# Altium schematic sheet 基础四轮--主板.SchDoc
size A3
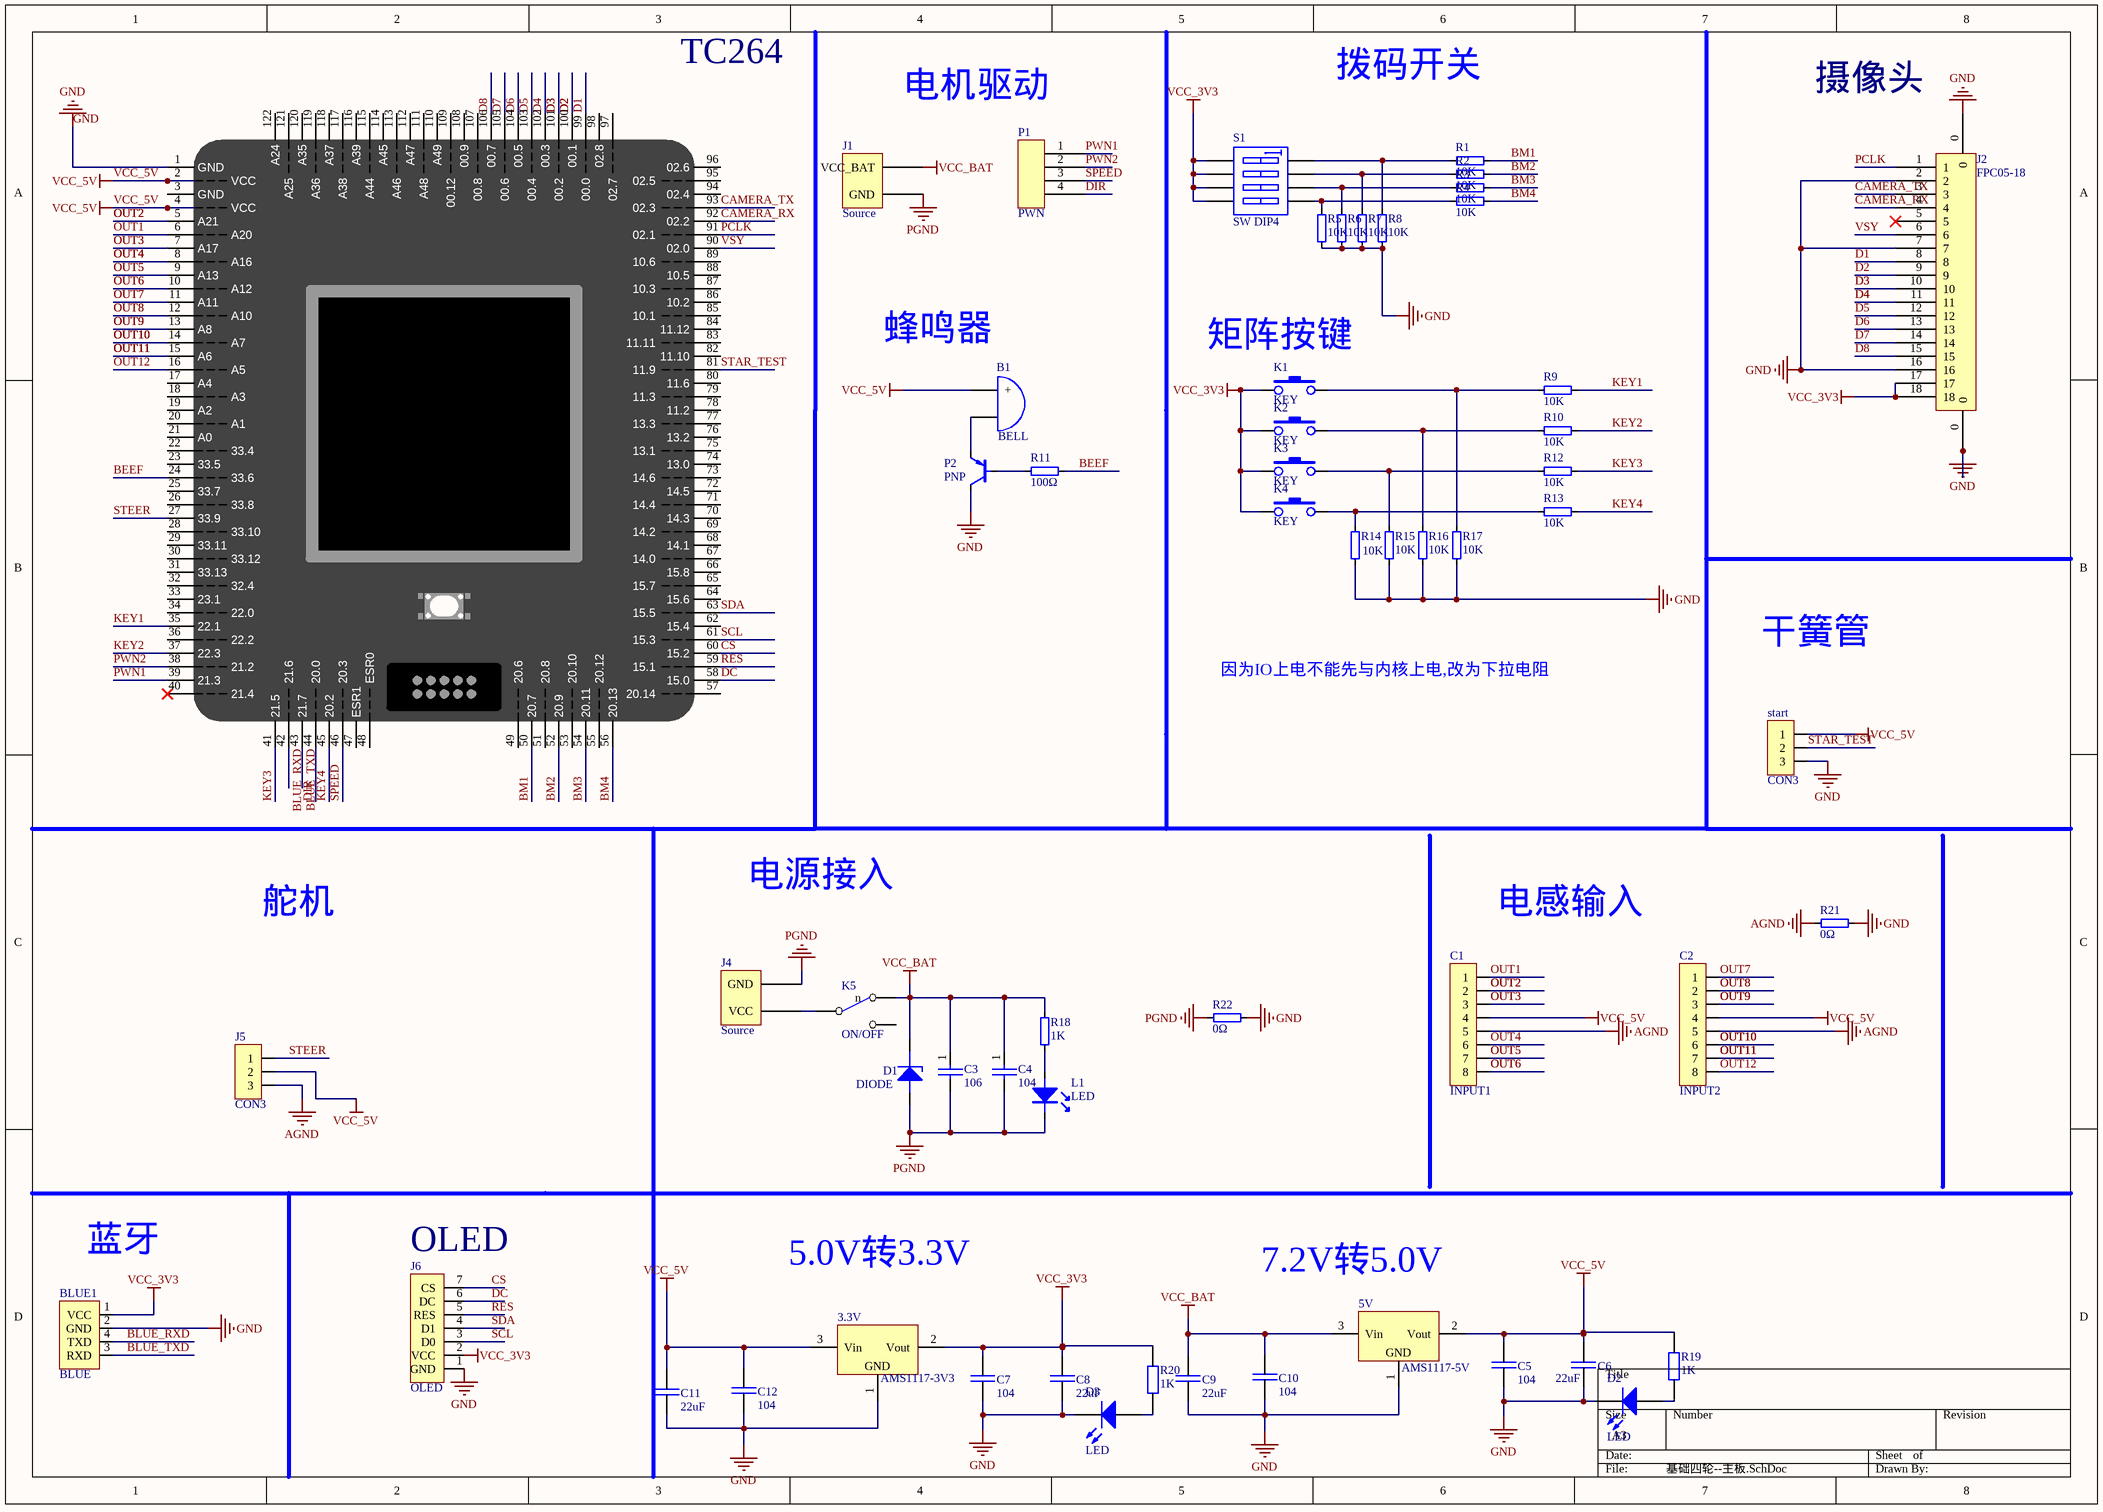
[diagram p0: 基础四轮--主板.SchDoc]

## Parts
3.3V  AMS1117-3V3  [SOT223_L]
5V  AMS1117-5V  [SOT223_L]
B1  BELL  [BELL]
BLUE1  BLUE  [CON4]
C1  INPUT1  [公CON8__INPUT]
C2  INPUT2  [公CON8__INPUT]
C3  106  [C0805]
C4  104  [C0805]
C5  104  [C 0603_L]
C6  22uF  [C 0603_L]
C7  104  [C 0603_L]
C8  22uF  [C 0603_L]
C9  22uF  [C 0603_L]
C10  104  [C 0603_L]
C11  22uF  [C 0603_L]
C12  104  [C 0603_L]
D1  DIODE  [SMA-DIODE]
D2  LED  [LED 0603Y]
D3  LED  [LED 0603B]
J1  Source  [KF 5.08]
J2  FPC05-18  [fpc_05_18p]
J4  Source  [XT30-M]
J5  CON3  [HDR2.54-LI-3P]
J6  OLED  [OLED 1.3-12864_7pin]
K1  KEY  [TSW SMD-3*6*5]
K2  KEY  [TSW SMD-3*6*5]
K3  KEY  [TSW SMD-3*6*5]
K4  KEY  [TSW SMD-3*6*5]
K5  ON/OFF  [拨动开关]
L1  LED  [0805LED]
P1  PWN  [公CON4]
P2  PNP  [SOT-23]
R1  10K  [R0805]
R2  10K  [R0805]
R3  10K  [R0805]
R4  10K  [R0805]
R5  10K  [R0805]
R6  10K  [R0805]
R7  10K  [R0805]
R8  10K  [R0805]
R9  10K  [R0805]
R10  10K  [R0805]
R11  100Ω  [R0805]
R12  10K  [R0805]
R13  10K  [R0805]
R14  10K  [R0805]
R15  10K  [R0805]
R16  10K  [R0805]
R17  10K  [R0805]
R18  1K  [R0805]
R19  1K  [R 0603_L]
R20  1K  [R 0603_L]
R21  0Ω  [R0603 M]
R22  0Ω  [R0603 M]
S1  SW DIP4  [编码开关 4p]
start  CON3  [公CON3]
U1  TC264_CoreBoard  [TC264_CoreBoard]  (value not drawn)

## Nets
AGND: C1.5 C2.5 J5.3 R21.1
GND: 3.3V.1(GND) 5V.1(GND) BLUE1.2(GND) C5.1 C6.1 C7.1 C8.1 C9.1 C10.1 C11.1 C12.1 D2.2(K) D3.2(K) J2.0 J2.2 J2.7 J2.16 J6.1(GND) P2.3(c) R5.1 R6.1 R7.1 R8.1 R14.2 R15.2 R16.2 R17.2 R21.2 R22.2 start.3 U1.1(GND)
PGND: C3.2 C4.2 D1.1 J1.1(GND) J4.2(GND) L1.2 R22.1
VCC_3V3: 3.3V.2(Vout) BLUE1.1(VCC) C7.2 C8.2 J2.17 J2.18 J6.2(VCC) K1.1 K2.1 K3.1 K4.1 R20.2 S1.1(A1) S1.2(A2) S1.3(A3) S1.4(A4)
VCC_5V: 3.3V.3(Vin) 5V.2(Vout) B1.1(+) C1.4 C2.4 C5.2 C6.2 C11.2 C12.2 J5.2 R19.2 start.1 U1.2(VCC) U1.4(VCC)
VCC_BAT: 5V.3(Vin) C3.1 C4.1 C9.2 C10.2 D1.2 J1.2(VCC_BAT) K5.1(n) R18.2
BEEF: R11.2 U1.24(33.6)
BLUE_RXD: BLUE1.4(TXD) U1.42(21.6)
BLUE_TXD: BLUE1.3(RXD) U1.43(21.7)
BM1: R1.2 U1.50(20.7)
BM2: R2.2 U1.52(20.9)
BM3: R3.2 U1.54(20.11)
BM4: R4.2 U1.56(20.13)
CAMERA_RX: J2.4 U1.92(02.2)
CAMERA_TX: J2.3 U1.93(02.3)
CS: J6.7(CS) U1.60(15.2)
D1: J2.8 U1.99(00.0)
D2: J2.9 U1.100(00.1)
D3: J2.10 U1.101(00.2)
D4: J2.11 U1.102(00.3)
D5: J2.12 U1.103(00.4)
D6: J2.13 U1.104(00.5)
D7: J2.14 U1.105(00.6)
D8: J2.15 U1.106(00.7)
DC: J6.6(DC) U1.58(15.0)
DIR: P1.4(PWN2) U1.44(20.0)
KEY1: R9.2 U1.35(22.1)
KEY2: R10.2 U1.37(22.3)
KEY3: R12.2 U1.41(21.5)
KEY4: R13.2 U1.45(20.2)
OUT1: C1.1 U1.6(A20)
OUT2: C1.2 U1.5(A21)
OUT3: C1.3 U1.7(A17)
OUT4: C1.6 U1.8(A16)
OUT5: C1.7 U1.9(A13)
OUT6: C1.8 U1.10(A12)
OUT7: C2.1 U1.11(A11)
OUT8: C2.2 U1.12(A10)
OUT9: C2.3 U1.13(A8)
OUT10: C2.6 U1.14(A7)
OUT11: C2.7 U1.15(A6)
OUT12: C2.8 U1.16(A5)
PCLK: J2.1 U1.91(02.1)
PWN1: P1.1(SPEED) U1.39(21.3)
PWN2: P1.2(DIR) U1.38(21.2)
RES: J6.5(RES) U1.59(15.1)
SCL: J6.3(D0) U1.61(15.3)
SDA: J6.4(D1) U1.63(15.5)
SPEED: P1.3(PWN1) U1.46(20.3)
STAR_TEST: start.2 U1.81(11.9)
STEER: J5.1 U1.27(33.9)
VSY: J2.6 U1.90(02.0)
NetB1_2: B1.2 P2.2(e)
NetD2_1: D2.1(A) R19.1
NetD3_1: D3.1(A) R20.1
NetJ4_1: J4.1(VCC) K5.2(O)
NetK1_2: K1.2 R9.1 R17.1
NetK2_2: K2.2 R10.1 R16.1
NetK3_2: K3.2 R12.1 R15.1
NetK4_2: K4.2 R13.1 R14.1
NetL1_1: L1.1 R18.1
NetP2_1: P2.1(b) R11.1
NetR1_1: R1.1 R8.2 S1.8(B1)
NetR2_1: R2.1 R7.2 S1.7(B2)
NetR3_1: R3.1 R6.2 S1.6(B3)
NetR4_1: R4.1 R5.2 S1.5(B4)

Not connected (* = marked no-connect by the designer): J2 5*; K5 3(COMMON); U1 3(GND) 17(A4) 18(A3) 19(A2) 20(A1) 21(A0) 22(33.4) 23(33.5) 25(33.7) 26(33.8) 28(33.10) 29(33.11) 30(33.12) 31(33.13) 32(32.4) 33(23.1) 34(22.0) 36(22.2) 40(21.4)* 47(ESR1) 48(ESR0) 49(20.6) 51(20.8) 53(20.10) 55(20.12) 57(20.14) 62(15.4) 64(15.6) 65(15.7) 66(15.8) 67(14.0) 68(14.1) 69(14.2) 70(14.3) 71(14.4) 72(14.5) 73(14.6) 74(13.0) 75(13.1) 76(13.2) 77(13.3) 78(11.2) 79(11.3) 80(11.6) 82(11.10) 83(11.11) 84(11.12) 85(10.1) 86(10.2) 87(10.3) 88(10.5) 89(10.6) 94(02.4) 95(02.5) 96(02.6) 97(02.7) 98(02.8) 107(00.8) 108(00.9) 109(00.12) 110(A49) 111(A48) 112(A47) 113(A46) 114(A45) 115(A44) 116(A39) 117(A38) 118(A37) 119(A36) 120(A35) 121(A25) 122(A24)

## Notes on the sheet
- TC264
- 电机驱动
- 拨码开关
- 摄像头
- 蜂鸣器
- (near K1) 矩阵按键
- 干簧管
- 因为IO上电不能先与内核上电,改为下拉电阻
- 舵机
- 电源接入
- 电感输入
- 蓝牙
- (near J6) OLED
- 5.0V转3.3V
- (near 5V) 7.2V转5.0V

## Library data of the parts
3.3V 5V = AMS1117: 三端稳压芯片; BOM名称: 稳压芯片; 淘宝ID: 封装库来自淘宝 ID：黄晶宝石; 欢迎光临淘宝店铺: https://shop463601444.taobao.com
B1 = BELL: 蜂鸣器
BLUE1 = 串口: 蓝牙
C1 C2 = CON-8
C3 C4 = CAP: 二极管
C5-C12 = C 0805: cap 0805
D1 = DIODE: 防反接二极管
D2 D3 = LED: Typical BLUE SiC LED; Published: 8-Jun-2000; LatestRevisionDate: 17-Dec-2003; LatestRevisionNote: PCB Footprint replaced.; DatasheetVersion: 16-Apr-2002; PackageVersion: 16-Apr-2002; PackageReference: 3.5X2.8X1.9; Publisher: Altium Limited; PackageDescription: SM LED; 2 C-Bend Leads; Body 3.5 x 2.8 x 1.9 mm, inc leads (LxWxH typ)
J1 J4 = Source: 电源接口
K5 = ON/OFF: 电源快关
L1 = LED: 发光二极管
R1-R18 = RES: 电阻
R19 R20 = R 0805: res 0805
R21 R22 = RES_1: 电阻
U1 = TC264_CoreBoard: 逐飞科技TC264核心板